# Altium schematic sheet USB_Switcher_v0.0.SchDoc
size A1; Organization: Protel International P/L; Address1: L3, 12a Rodborough Rd; Address2: Frenchs Forest; Address3: NSW; Address4: Australia 2086
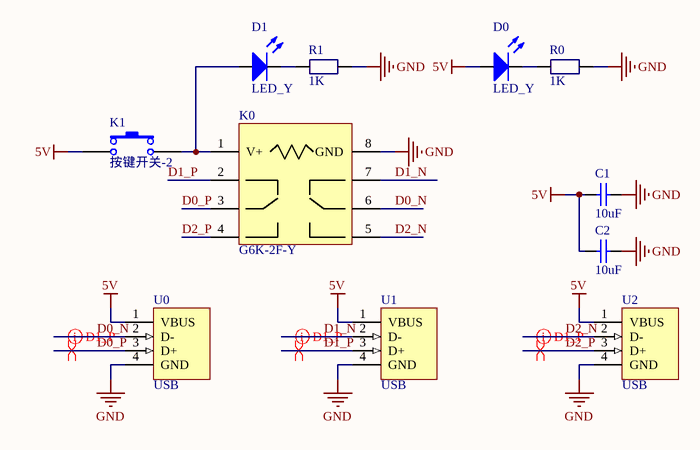
[diagram p0: USB_Switcher_v0.0.SchDoc]

## Parts
C1  10uF  [1206-C]
C2  10uF  [1206-C]
D0  LED_Y  [LED-0805-YEL]
D1  LED_Y  [LED-0805-YEL]
K0  G6K-2F-Y  [G6K-2F-Y]
K1  按键开关-2  [KAN9A_2P_ON-OFF]
R0  1K  [0402-R]
R1  1K  [0402-R]
U0  USB  [USB-A]
U1  USB  [USB-A]
U2  USB  [USB-A]

## Nets
5V: C1.2 C2.2 D0.1 K1.1 U0.1(VBUS) U1.1(VBUS) U2.1(VBUS)
GND: C1.1 C2.1 K0.8(GND) R0.2 R1.2 U0.4(GND) U1.4(GND) U2.4(GND)
D0_N: K0.6 U0.2(D-)
D0_P: K0.3 U0.3(D+)
D1_N: K0.7 U1.2(D-)
D1_P: K0.2 U1.3(D+)
D2_N: K0.5 U2.2(D-)
D2_P: K0.4 U2.3(D+)
NetD0_2: D0.2 R0.1
NetD1_1: D1.1 K0.1(V+) K1.2
NetD1_2: D1.2 R1.1

## Layout directives
differential pair: D0_N, D0_P, D1_N, D1_P, D2_N, D2_P

## Notes on the sheet
- Title
- Size:
- Date:
- File:
- A1
- Number:
- Time:
- Revision:
- Sheet
- of

## Library data of the parts
C1 C2 = CAP-无极性: 电容类
D0 D1 = LED
K0 = G6K: 双刀信号继电器
R0 R1 = RES: 电阻类
U0-U2 = USB-2.0